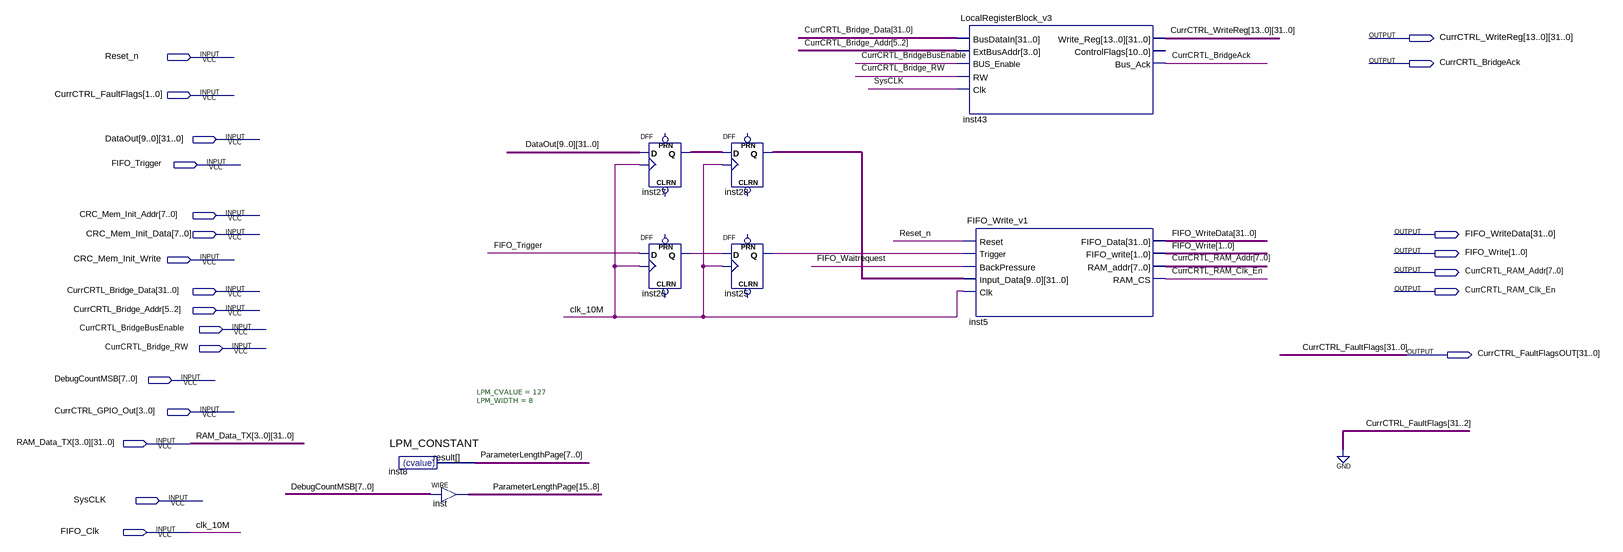
[diagram p0: schematic sheet]
// Quartus schematic CurrCTRL_CPU_Interfacev1.bdf as structural Verilog: 8 symbols, 23 pins
module CurrCTRL_CPU_Interfacev1 (
  input  Reset_n,
  input  [1:0] CurrCTRL_FaultFlags,
  input  [31:0] DataOut_9,
  input  [31:0] DataOut_8,
  input  [31:0] DataOut_7,
  input  [31:0] DataOut_6,
  input  [31:0] DataOut_5,
  input  [31:0] DataOut_4,
  input  [31:0] DataOut_3,
  input  [31:0] DataOut_2,
  input  [31:0] DataOut_1,
  input  [31:0] DataOut_0,
  input  FIFO_Trigger,
  input  [7:0] CRC_Mem_Init_Addr,
  input  [7:0] CRC_Mem_Init_Data,
  input  CRC_Mem_Init_Write,
  input  [31:0] CurrCRTL_Bridge_Data,
  input  [5:2] CurrCRTL_Bridge_Addr,
  input  CurrCRTL_BridgeBusEnable,
  input  CurrCRTL_Bridge_RW,
  input  [7:0] DebugCountMSB,
  input  [3:0] CurrCTRL_GPIO_Out,
  input  [31:0] RAM_Data_TX_3,
  input  [31:0] RAM_Data_TX_2,
  input  [31:0] RAM_Data_TX_1,
  input  [31:0] RAM_Data_TX_0,
  input  SysCLK,
  input  FIFO_Clk,
  output [31:0] CurrCTRL_WriteReg_13,
  output [31:0] CurrCTRL_WriteReg_12,
  output [31:0] CurrCTRL_WriteReg_11,
  output [31:0] CurrCTRL_WriteReg_10,
  output [31:0] CurrCTRL_WriteReg_9,
  output [31:0] CurrCTRL_WriteReg_8,
  output [31:0] CurrCTRL_WriteReg_7,
  output [31:0] CurrCTRL_WriteReg_6,
  output [31:0] CurrCTRL_WriteReg_5,
  output [31:0] CurrCTRL_WriteReg_4,
  output [31:0] CurrCTRL_WriteReg_3,
  output [31:0] CurrCTRL_WriteReg_2,
  output [31:0] CurrCTRL_WriteReg_1,
  output [31:0] CurrCTRL_WriteReg_0,
  output CurrCRTL_BridgeAck,
  output [31:0] FIFO_WriteData,
  output [1:0] FIFO_Write,
  output [7:0] CurrCRTL_RAM_Addr,
  output CurrCRTL_RAM_Clk_En,
  output [31:0] CurrCTRL_FaultFlagsOUT
);

  wire FIFO_Waitrequest, inst25_q, inst26_q;
  wire [15:0] ParameterLengthPage;
  wire [319:0] inst27_q, inst28_q;

  LPM_CONSTANT #(.LPM_CVALUE(127), .LPM_WIDTH(8)) inst8 (.result(ParameterLengthPage[7:0]));
  assign ParameterLengthPage[15:8] = DebugCountMSB;  // WIRE inst
  DFF inst27[319:0] (
    .CLK(FIFO_Clk),
    .D({DataOut_9, DataOut_8, DataOut_7, DataOut_6, DataOut_5, DataOut_4, DataOut_3, DataOut_2, DataOut_1, DataOut_0}),
    .Q(inst27_q));  // open: CLRN, PRN
  DFF inst26 (.CLK(FIFO_Clk), .D(FIFO_Trigger), .Q(inst26_q));  // open: CLRN, PRN
  DFF inst28[319:0] (.CLK(FIFO_Clk), .D(inst27_q), .Q(inst28_q));  // open: CLRN, PRN
  DFF inst25 (.CLK(FIFO_Clk), .D(inst26_q), .Q(inst25_q));  // open: CLRN, PRN
  LocalRegisterBlock_v3 inst43 (
    .BusDataIn(CurrCRTL_Bridge_Data), .ExtBusAddr(CurrCRTL_Bridge_Addr),
    .BUS_Enable(CurrCRTL_BridgeBusEnable), .RW(CurrCRTL_Bridge_RW), .Clk(SysCLK),
    .Write_Reg({CurrCTRL_WriteReg_13, CurrCTRL_WriteReg_12, CurrCTRL_WriteReg_11, CurrCTRL_WriteReg_10, CurrCTRL_WriteReg_9, CurrCTRL_WriteReg_8, CurrCTRL_WriteReg_7, CurrCTRL_WriteReg_6, CurrCTRL_WriteReg_5, CurrCTRL_WriteReg_4, CurrCTRL_WriteReg_3, CurrCTRL_WriteReg_2, CurrCTRL_WriteReg_1, CurrCTRL_WriteReg_0}),
    .Bus_Ack(CurrCRTL_BridgeAck));  // open: ControlFlags
  FIFO_Write_v1 inst5 (
    .Reset(Reset_n), .Trigger(inst25_q), .BackPressure(FIFO_Waitrequest), .Input_Data(inst28_q),
    .Clk(FIFO_Clk), .FIFO_Data(FIFO_WriteData), .FIFO_write(FIFO_Write), .RAM_addr(CurrCRTL_RAM_Addr),
    .RAM_CS(CurrCRTL_RAM_Clk_En));

  assign CurrCTRL_FaultFlagsOUT = {{30{1'b0}}, CurrCTRL_FaultFlags};

  // Other names for the same wires on the sheet: clk_10M = FIFO_Clk
endmodule
